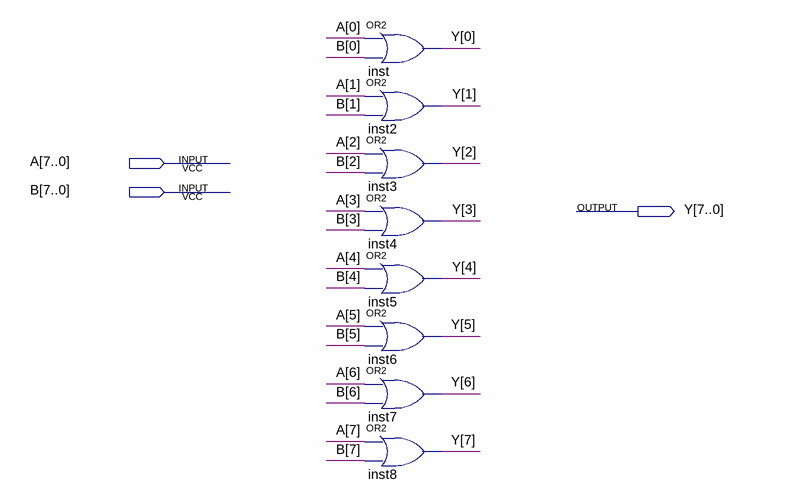
[diagram p0: schematic sheet]
// Quartus schematic or8bit.bdf as structural Verilog: 8 symbols, 3 pins
module or8bit (
  input  [7:0] A,
  input  [7:0] B,
  output [7:0] Y
);

  or inst (Y[0], A[0], B[0]);
  or inst2 (Y[1], A[1], B[1]);
  or inst3 (Y[2], A[2], B[2]);
  or inst4 (Y[3], A[3], B[3]);
  or inst5 (Y[4], A[4], B[4]);
  or inst6 (Y[5], A[5], B[5]);
  or inst7 (Y[6], A[6], B[6]);
  or inst8 (Y[7], A[7], B[7]);
endmodule
